# EAGLE schematic 411_AutoFan (V1.2) (EAGLE 9.6.2)
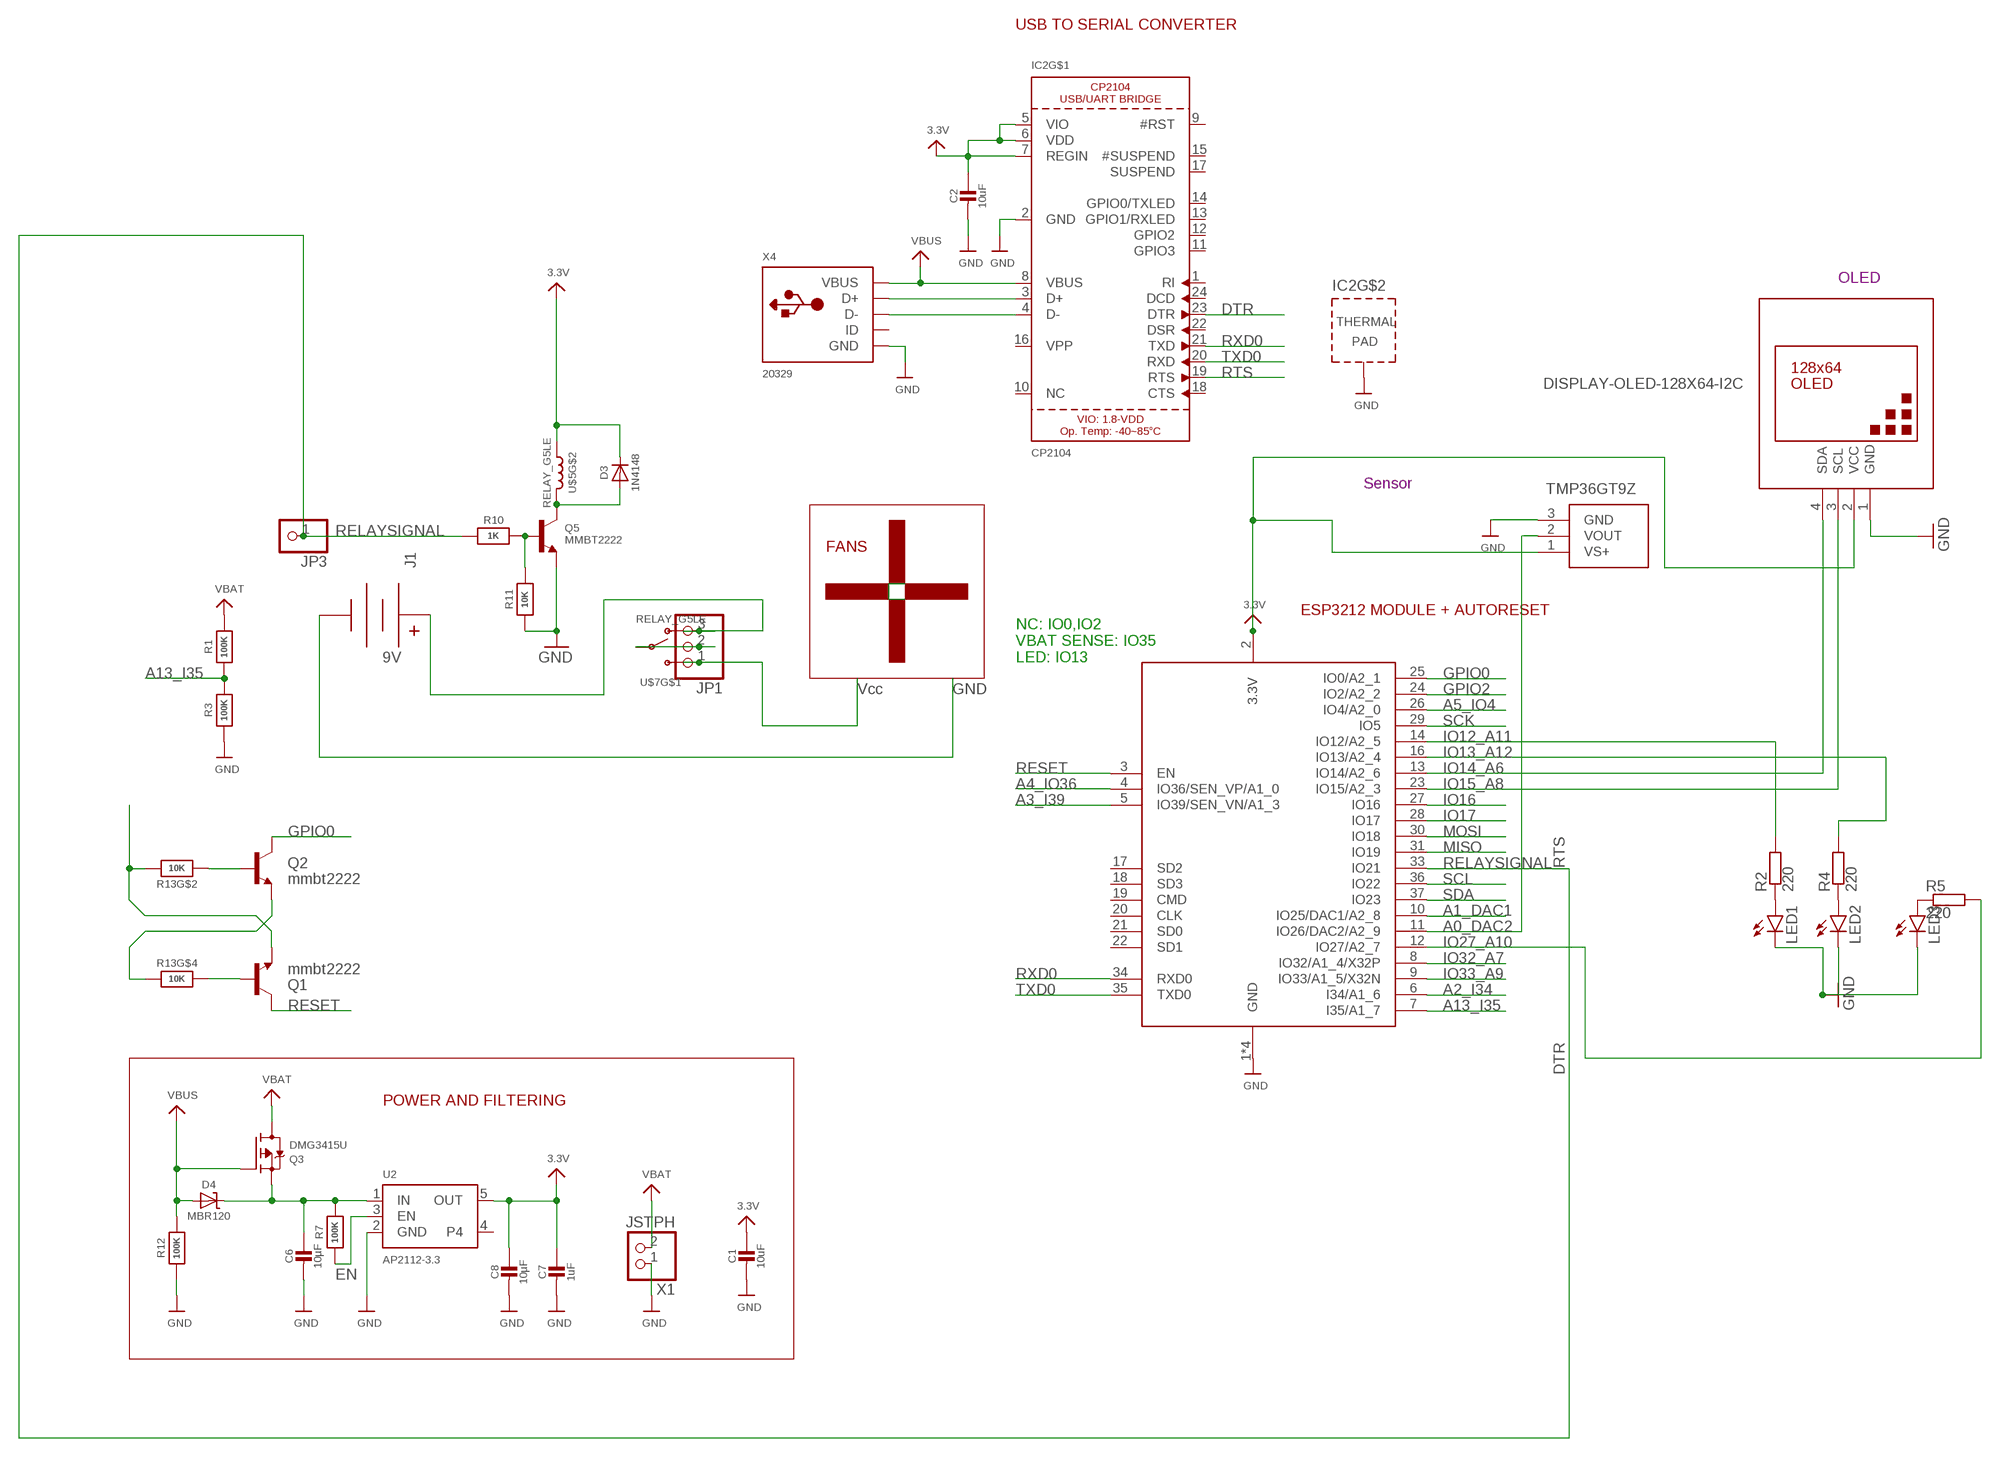
[diagram p0: schematic, sheet 1]

## Parts
C1  10uF  CAP_CERAMIC0805-NOOUTLINE  [0805-NO]
C2  10uF  CAP_CERAMIC0805-NOOUTLINE  [0805-NO]
C6  10µF  CAP_CERAMIC0805-NOOUTLINE  [0805-NO]
C7  1uF  CAP_CERAMIC0603_NO  [0603-NO]
C8  10µF  CAP_CERAMIC0805-NOOUTLINE  [0805-NO]
D3  1N4148  DIODESOD-323  [SOD-323]
D4  MBR120  DIODE-SCHOTTKYSOD-123  [SOD-123]
IC2  CP2104  [QFN24_4MM_SMSC]
J1  BC9VPC  [BC9VPC]
JP1  HEADER-1X3_508TERM  [TERMBLOCK_1X3_5.08MM]
JP3  HEADER-1X1ROUND  [1X01_ROUND]
LED1  LED5MM  [LED5MM]
LED2  LED5MM  [LED5MM]
LED3  LED5MM  [LED5MM]
Q1  mmbt2222  TRANSISTOR_NPNSOT23-3  [SOT23-3]
Q2  mmbt2222  TRANSISTOR_NPNSOT23-3  [SOT23-3]
Q3  DMG3415U  MOSFET-P  [SOT23-R]
Q5  MMBT2222  TRANSISTOR_NPN  [SOT23-R]
R1  100K  RESISTOR_0603_NOOUT  [0603-NO@2]
R2  220  BVS  [BVS]
R3  100K  RESISTOR_0603_NOOUT  [0603-NO@2]
R4  220  BVS  [BVS]
R5  220  BVS  [BVS]
R7  100K  RESISTOR_0603_NOOUT  [0603-NO@2]
R10  1K  RESISTOR0805_NOOUTLINE  [0805-NO]
R11  10K  RESISTOR0805_NOOUTLINE  [0805-NO]
R12  100K  RESISTOR_0603_NOOUT  [0603-NO@2]
R13  10K  RESISTOR_4PACK  [RESPACK_4X0603]
RT2  TMP36GT9Z  [TO-92]
U2  AP2112-3.3  VREG_SOT23-5  [SOT23-5]
U$5  RELAY_G5LE  [RELAY_G5LE-1]
U$6  DISPLAY-OLED-128X64-I2C  [DISPLAY-OLED-128X64-I2C]
U$7  RELAY_G5LE  [RELAY_G5LE-1]
X1  JSTPH  CON_JST_PH_2PIN  [JSTPH2]
X2  ESP32_WROOM32_SKINNY  [WROOM32_SKINNY]
X4  20329  USB_MICRO_20329_V2  [4UCONN_20329_V2]

## Nets
3.3V: C1.1 C2.1 C7.1 C8.1 D3.C IC2.5(VIO) IC2.6(VDD) IC2.7(REGIN) RT2.1(VS+) U2.5(OUT) U$5.2 U$6.2(VCC) X2.2(3.3V)
A0_DAC2: RT2.2(VOUT) X2.11(IO26/DAC2/A2_9)
A1_DAC1: X2.10(IO25/DAC1/A2_8)
A2_I34: X2.6(I34/A1_6)
A3_I39: X2.5(IO39/SEN_VN/A1_3)
A4_IO36: X2.4(IO36/SEN_VP/A1_0)
A5_IO4: X2.26(IO4/A2_0)
A13_I35: R1.1 R3.2 X2.7(I35/A1_7)
DTR: IC2.23(DTR) Q2.2(E) R13.4
EN: R7.1 U2.3(EN)
GND: C1.2 C2.2 C6.2 C7.2 C8.2 IC2.2(GND) IC2.THERM(TP) LED1.K(C) LED2.K(C) LED3.K(C) Q5.2(E) R3.1 R11.1 R12.1 RT2.3(GND) U2.2(GND) U$6.1(GND) X1.1 X2.1(GND) X2.15(GND) X2.38(GND) X2.P$1(GND) X4.BASE@1(GND) X4.BASE@2(GND) X4.GND X4.SPRT@1(GND) X4.SPRT@2(GND) X4.SPRT@3(GND) X4.SPRT@4(GND)
GPIO0: Q2.3(C) X2.25(IO0/A2_1)
GPIO2: X2.24(IO2/A2_2)
IO12_A11: LED2.A R2.1 R4.2 X2.14(IO12/A2_5)
IO13_A12: R4.1 X2.16(IO13/A2_4)
IO14_A6: U$6.4(SDA) X2.13(IO14/A2_6)
IO15_A8: U$6.3(SCL) X2.23(IO15/A2_3)
IO16: X2.27(IO16)
IO17: X2.28(IO17)
IO27_A10: R5.1 X2.12(IO27/A2_7)
IO32_A7: X2.8(IO32/A1_4/X32P)
IO33_A9: X2.9(IO33/A1_5/X32N)
MISO: X2.31(IO19)
MOSI: X2.30(IO18)
N$2: LED1.A R2.2
N$3: LED3.A R5.2
N$5: JP1.1 U$7.4(S)
N$6: J1.V-
N$7: C6.1 D4.C Q3.2(S) R7.2 U2.1(IN)
N$8: J1.V+ JP1.3 U$7.3(O)
N$9: JP1.2 U$7.1(P)
N$10: IC2.3(D+) X4.D+
N$11: IC2.4(D-) X4.D-
N$12: Q1.1(B) R13.5
N$13: Q2.1(B) R13.2
N$15: D3.A Q5.3(C) U$5.5
N$16: Q5.1(B) R10.2 R11.2
RELAYSIGNAL: JP3.1 R10.1 X2.33(IO21)
RESET: Q1.3(C) X2.3(EN)
RTS: IC2.19(RTS) Q1.2(E) R13.7
RXD0: IC2.21(TXD) X2.34(RXD0)
SCK: X2.29(IO5)
SCL: X2.36(IO22)
SDA: X2.37(IO23)
TXD0: IC2.20(RXD) X2.35(TXD0)
VBAT: Q3.3(D) R1.2 X1.2
VBUS: D4.A IC2.8(VBUS) Q3.1(G) R12.2 X4.VBUS
Unconnected: IC2.1(RI) IC2.9(#RST) IC2.10(NC) IC2.11(GPIO3) IC2.12(GPIO2) IC2.13(GPIO1/RXLED) IC2.14(GPIO0/TXLED) IC2.15(#SUSPEND) IC2.16(VPP) IC2.17(SUSPEND) IC2.18(CTS) IC2.22(DSR) IC2.24(DCD) R13.1 R13.3 R13.6 R13.8 U2.4 U$5.1(P) U$5.3(O) U$5.4(S) U$7.2 U$7.5 X2.17(SD2) X2.18(SD3) X2.19(CMD) X2.20(CLK) X2.21(SD0) X2.22(SD1) X4.ID

## Notes on the sheet
- USB TO SERIAL CONVERTER
- OLED
- Sensor
- FANS
- ESP3212 MODULE + AUTORESET
- 9V
- NC: IO0,IO2
  VBAT SENSE: IO35
  LED: IO13
- Vcc | GND
- POWER AND FILTERING

## Library data of the parts
C1 C2 C6-C8 = microbuilder:CAP_CERAMIC: Ceramic Capacitors For new designs, use the packages preceded by an '_' character since they are more reliable: The following footprints should be used on most boards: _0402 - Standard footprint for regular board layouts _0603 - Standard footprint for regular board layouts _0805 - Standard footprint for regular board layouts _1206 - Standard footprint for regular board layouts For extremely tight-pitch boards where space is at a premium, the following 'micro-pitch' footprints can be used (smaller pads, no silkscreen outline, etc.): _0402MP - Micro-pitch footprint for very dense/compact boards _0603MP - Micro-pitch footprint for very dense/compact boards _0805MP - Micro-pitch footprint for very dense/compact boards _1206MP - Micro-pitch footprint for very dense/compact boards
D3 = microbuilder:DIODE: Diode SMA Model Volts Amps Type Vf Ir Digikey # Notes SSA34-E3 40V 3A Schottky 480mV @ 3A 200uA @ 40V SSA34-E3/61TGITR-ND CDBA120-G 20V 1A Schottky 500mV @ 1A 500uA @ 20V 641-1014-6-ND REEL MBRA210 10V 2A Schottky 350mV @ 2A 700uA @ 10V MBRA210LT3 SOD-123 Model Volts Amps Type Vf Ir Order # Notes BAT54T1G 30V 200mA Schottky 800mV @ 200mA 2uA @ 25V BAT54T1GOSTR-ND B0530W 30V 500mA Schottky 430mV @ 500mA 130uA @ 30V B0530W-FDICT-ND REEL MBR120 20V 1A Schottky 340mV @ 1A MBR120VLSFT1GOSCT-ND SOD-323 Model Volts Amps Type Vf Ir Order # Notes PMEG2005EJ 20V 500mA Schottky 355mV @ 500mA 568-4110-1-ND ZLLS410 10V 570mA Schottky 380mV @ 570mA ZLLS410CT-ND 1N4148WS 75V 150mA Silicon/Simple 1V 1N4148WSFSCT-ND REEL SOD-523 Model Volts Amps Type Vf Ir Order # Notes BAT54XV2 30V 200mA Schottky 0.8V @ 100mA BAT54XV2CT-ND TB751S 30V 30mA Schottky RB751S-40TE61CT-ND SOT23-R/W (R = Solder Paste/Reflow Ovens, W = Hand-Soldering) Model Volts Amps Type Vf Ir Order # Notes BAT54FILM 40V 300mA Schottky 497-7162-1-ND POWERDI-5 Model Volts Amps Type Vf Ir Order # Notes PDS560 60V 5A Schottky 670mV @ 5A 150uA @ 60V PDS560DICT-ND
D4 = microbuilder:DIODE-SCHOTTKY
IC2 = microbuilder:CP2104: CP2104 - USB to UART Bridge VDD Output: 3.45V
J1 = SparkFun-Connectors:BC9VPC: 9V Battery Holder - PC Mount Standard and Kit footprints included SparkFun Products: SparkFun SparkPunk Sound Kit <https://www.sparkfun.com/products/11177> SparkFun SparkPunk Sequencer Kit <https://www.sparkfun.com/products/12707>; PROD_ID: BATT-10855
JP1 = microbuilder:HEADER-1X3: PIN HEADER
JP3 = microbuilder:HEADER-1X1: PIN HEADER
LED1-LED3 = led:LED: LED OSRAM: - CHIPLED LG R971, LG N971, LY N971, LG Q971, LY Q971, LO R971, LY R971 LH N974, LH R974 LS Q976, LO Q976, LY Q976 LO Q996 - Hyper CHIPLED LW Q18S LB Q993, LB Q99A, LB R99A - SideLED LS A670, LO A670, LY A670, LG A670, LP A670 LB A673, LV A673, LT A673, LW A673 LH A674 LY A675 LS A676, LA A676, LO A676, LY A676, LW A676 LS A679, LY A679, LG A679 - Hyper Micro SIDELED® LS Y876, LA Y876, LO Y876, LY Y876 LT Y87S - SmartLED LW L88C, LW L88S LB L89C, LB L89S, LG L890 LS L89K, LO L89K, LY L89K LS L896, LA L896, LO L896, LY L896 - TOPLED LS T670, LO T670, LY T670, LG T670, LP T670 LSG T670, LSP T670, LSY T670, LOP T670, LYG T670 LG T671, LOG T671, LSG T671 LB T673, LV T673, LT T673, LW T673 LH T674 LS T676, LA T676, LO T676, LY T676, LB T676, LH T676, LSB T676, LW T676 LB T67C, LV T67C, LT T67C, LS T67K, LO T67K, LY T67K, LW E67C LS E67B, LA E67B, LO E67B, LY E67B, LB E67C, LV E67C, LT E67C LW T67C LS T679, LY T679, LG T679 LS T770, LO T770, LY T770, LG T770, LP T770 LB T773, LV T773, LT T773, LW T773 LH T774 LS E675, LA E675, LY E675, LS T675 LS T776, LA T776, LO T776, LY T776, LB T776 LHGB T686 LT T68C, LB T68C - Hyper Mini TOPLED® LB M676 - Mini TOPLED Santana® LG M470 LS M47K, LO M47K, LY M47K Source: http://www.osram.convergy.de LUXEON: - LUMILED® LXK2-PW12-R00, LXK2-PW12-S00, LXK2-PW14-U00, LXK2-PW14-V00 LXK2-PM12-R00, LXK2-PM12-S00, LXK2-PM14-U00 LXK2-PE12-Q00, LXK2-PE12-R00, LXK2-PE12-S00, LXK2-PE14-T00, LXK2-PE14-U00 LXK2-PB12-K00, LXK2-PB12-L00, LXK2-PB12-M00, LXK2-PB14-N00, LXK2-PB14-P00, LXK2-PB14-Q00 LXK2-PR12-L00, LXK2-PR12-M00, LXK2-PR14-Q00, LXK2-PR14-R00 LXK2-PD12-Q00, LXK2-PD12-R00, LXK2-PD12-S00 LXK2-PH12-R00, LXK2-PH12-S00 LXK2-PL12-P00, LXK2-PL12-Q00, LXK2-PL12-R00 Source: www.luxeon.com KINGBRIGHT: KA-3528ASYC Source: www.kingbright.com
Q1 Q2 = SparkFun:TRANSISTOR_NPN: Transistor NPN BJT configuration in SOT23 package. MMBT2222 is the common NPN we use. Double check BCE configuration again layout.
Q3 = microbuilder:MOSFET-P: P-Channel Mosfet LEGEND VDS: Voltage Drain-Source ID: Drain Current RDS(ON): Drain-Source On-State Resistance VGS(TH): Gate-Source Threshold Voltage CISS: Drain-Source Input Capacitance SOT-23 Name VDS ID RDS(ON) VGS(TH) CISS Order Number IRLML5103 30V 760mA 600 mOhm -- 75pF @ 25V Digikey: IRLML5103PBFCT-ND IRLML6401 12V 4.3A 50 mOhm 950mV @ 250µA 830pF @ 10V Digikey: IRLML6401PBFTR-ND NTR0202PL 20V 400mA 800 mOhm 2.3V @ 250uA 70pF @ 5V Digikey: NTR0202PLT1GOSTR-ND NTR4101PT1G 20V 1.8A 85 mOhm 1.2V @ 250uA 675pF @ 10V Digikey: NTR4101PT1GOSCT-ND DMP2004K 20V 600mA 900 mOhm 1V @ 250uA 175pF @ 16V Digikey: DMP2004KDICT-ND PMV65XP 20V 3.9A 76 mOhm 950mV @ 1mA 725pF @ 20V Digikey: 568-2358-2-ND TO-252 Name VDS ID RDS(ON) VGS(TH) CISS Order Number AOD417 30V 25A 34 mOhm 3V @ 250µA 920pF @ 15V Digikey: 785-1106-2-ND PowerPak Name VDS ID RDS(ON) VGS(TH) CISS Order Number AON7401 30V 12A 14 mOhm 3V @ 250µA 2600pF @ 15V Digikey: 785-1302-1-ND
Q5 = microbuilder:TRANSISTOR_NPN: NPN Transistor Transistor (NPN) 500mA 45V - BC817 [Digikey: 568-1631-1-ND] Transistor (NPN) 500mA 45V - BC817,215 [Mouser: 771-BC817-T/R] SOT23-R - SOT23 footprint optimised for use with solder paste and reflow ovens. SOT23-W - SOT23 footprint optimised for hand-soldering (larger pads).
R1 R3 R7 R10-R12 = microbuilder:RESISTOR: Resistors For new designs, use the packages preceded by an '_' character since they are more reliable: The following footprints should be used on most boards: _0402 - Standard footprint for regular board layouts _0603 - Standard footprint for regular board layouts _0805 - Standard footprint for regular board layouts _1206 - Standard footprint for regular board layouts For extremely tight-pitch boards where space is at a premium, the following 'micro-pitch' footprints can be used (smaller pads, no silkscreen outline, etc.): _0402MP - Micro-pitch footprint for very dense/compact boards _0603MP - Micro-pitch footprint for very dense/compact boards _0805MP - Micro-pitch footprint for very dense/compact boards _1206MP - Micro-pitch footprint for very dense/compact boards
R2 R4 R5 = resistor-shunt:BVS: SMD SHUNT RESISTOR; OC_FARNELL: unknown; OC_NEWARK: unknown
R13 = microbuilder:RESISTOR_4PACK: Resistor Packs (4 resistors) 4 x 0603 10K 1/16W - Digikey: YC164J-10KCT-ND
RT2 = TMP36GT9Z:TMP36GT9Z: TMP36GT9Z, Temperature Sensor +/-3C Serial-2 Wire 2.7 5.5 V 3-Pin TO-92 Source: Datasheet <http://docs-emea.rs-online.com/webdocs/0ae1/0900766b80ae1656.pdf>; ARROW_PART_NUMBER: TMP36GT9Z; ARROW_PRICE-STOCK: https://www.arrow.com/en/products/tmp36gt9z/analog-devices; DESCRIPTION: TMP36GT9Z, Temperature Sensor +/-3C Serial-2 Wire 2.7 5.5 V 3-Pin TO-92; HEIGHT: mm; MANUFACTURER_NAME: Analog Devices; MANUFACTURER_PART_NUMBER: TMP36GT9Z; MOUSER_PART_NUMBER: 584-TMP36GT9Z; MOUSER_PRICE-STOCK: https://www.mouser.co.uk/ProductDetail/Analog-Devices/TMP36GT9Z?qs=WIvQP4zGanhT97N47MSoHw%3D%3D
U2 = microbuilder:VREG_SOT23-5: SOT23-5 Fixed Voltage Regulators Part Current Out V Out V In V Dropout θJA (°C/W) TJ (°C) Digikey Part No. ADP121 150mA 3.3V 3.4-5.5V 0.09V @ 150mA -- -- ADP121-AUJZ33R7CT-ND ADP121 150mA 3.0V 3.1-5.5V 0.09V @ 150mA -- -- ADP121-AUJZ30R7CT-ND ADP122 300mA 3.3V 3.4-5.5V 0.085V @ 300mA -- -- ADP122AUJZ-3.3-R7CT-ND ADP1712 300mA 3.3V 3.5-5.5V 0.17V @ 300mA -- -- ADP1712AUJZ-3.3-R7TR-ND AP7311 (Low Cost) 150mA 3.3V 3.5-6V 0.15V @ 150mA -- -- AP7311-33WG-7DICT-ND LD39015M18R 150mA 1.8V 1.9V-5.5V 0.08V @ 100mA -- -- 497-6977-1-ND LP2985A-33DBVR 150mA 3.3V 3.3-16V 0.28V @ 150mA 206 150 296-18479-1-ND MCP1824T-3302E/OT 300mA 3.3V 3.5V-6V 0.2V @ 300mA -- -- MCP1824T-3302E/OTCT-ND MIC5205-2.5YM5 TR 150mA 2.5V 2.7-16V 0.165V @ 150mA -- -- 576-1257-2-ND MIC5205-3.0YM5 TR 150mA 3.0V 3.2V-16V 0.165V @ 150mA -- -- 576-1258-2-ND MIC5205-3.3YM5 TR 150mA 3.3V 3.5V-16V 0.165V @ 150mA -- -- 576-1259-2-ND TPS780330220 150mA 3.3V+2.2V 3.6-5.5V 250mV Max -- -- 296-23332-1-ND TDA3663/N1,135 100mA 3.3V 3.5-45V 0.18V @ 50mA -- -- 568-5343-1-ND Max operating temp can be calculated using θJA, TJ (max junction temperature), and power in watts. Set the "Maximum Ambient Temperature" until it reaches TJ ("Max Junction Temperature"), which is the absolute limit for safe use of the regulator: Heat Sink Temperature Calculator <http://www.daycounter.com/Calculators/Heat-Sink-Temperature-Calculator.phtml> For example, With 12V source into a 3.3V LP2985 and a 30mA load, we are dissipating (12V-3.3V) * 0.03A = 0.261W. With a θJA of 206 °C/W, a TJ of 150°C, and 261mW we can safely use the chip without a heat sink up to 75°C (=147.1°C Junction Temperature).
U$5 U$7 = microbuilder:RELAY_G5LE
U$6 = diy-modules:DISPLAY-OLED-128X64-I2C: 128x64 Dot Matrix OLED Module based on SSD1306 chip Variant with I2C interface More details available here: http://www.instructables.com/id/Monochrome-096-i2c-OLED-display-with-arduino-SSD13/ SSD1306 datasheet: https://cdn-shop.adafruit.com/datasheets/SSD1306.pdf Click here to find device on ebay.com <http://www.ebay.com/sch/oled+display+128x64+iic> Note: There are two variants: I2C and SPI. Search for the proper version.
X1 = microbuilder:CON_JST_PH_2PIN: JST 2-Pin Right-Angle Connector PH-Series - 4UConnector: 17311 SH-Series - 4UConnector: 07278
X2 = microbuilder:ESP32_WROOM32
X4 = microbuilder:USB: USB Connectors USBMINIB - Surface Mount Female Mini-B USB Connector 4UConnector: 06564